# EAGLE design DoDecaCharlieCylonCR2032 (EAGLE 7.5.0)
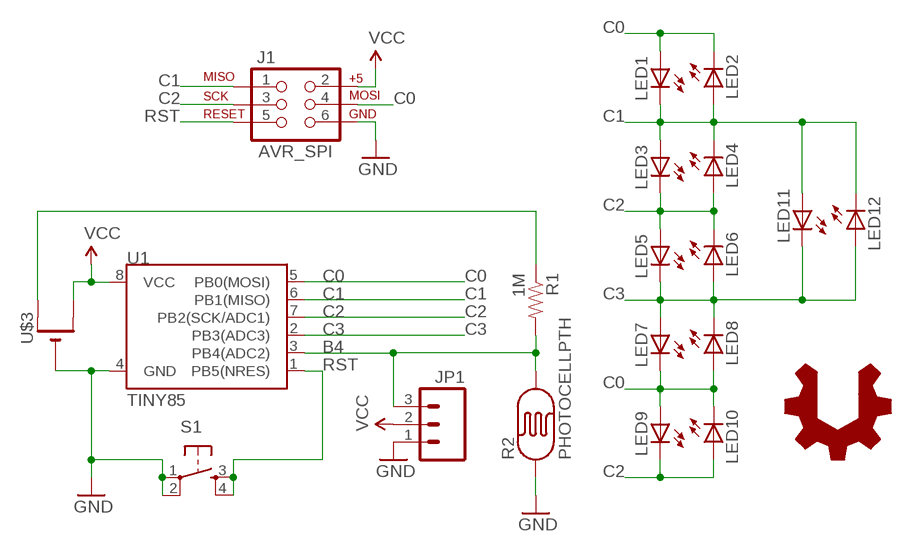
[diagram p0: schematic, sheet 1]

## Parts
J1  AVR_SPI  AVR_SPI_PRG_6LABELED  [2X3-NS]
JP1  M03PTH  [1X03]
LED1  LEDOVAL  [LED-OVAL]
LED2  LEDOVAL  [LED-OVAL]
LED3  LEDOVAL  [LED-OVAL]
LED4  LEDOVAL  [LED-OVAL]
LED5  LEDOVAL  [LED-OVAL]
LED6  LEDOVAL  [LED-OVAL]
LED7  LEDOVAL  [LED-OVAL]
LED8  LEDOVAL  [LED-OVAL]
LED9  LEDOVAL  [LED-OVAL]
LED10  LEDOVAL  [LED-OVAL]
LED11  LEDOVAL  [LED-OVAL]
LED12  LEDOVAL  [LED-OVAL]
R1  1M  RESISTORAXIAL-0.3  [AXIAL-0.3]
R2  PHOTOCELLPTH  [PHOTOCELL]
S1  TAC_SWITCHPTH  [TACTILE-PTH]
U1  TINY85  ATTINY45TINY85-20-DIP  [DIP08]
U$1  USER_HACKABLE  [USER_HACKABLE]
U$3  CR2032THM  [CR2032-THRU]

## Nets
B4: JP1.3 R1.P$2 R2.2 U1.3(PB4(ADC2))
C0: J1.4(MOSI) LED1.ANODE(A) LED2.CATHODE(C) LED7.CATHODE(C) LED8.ANODE(A) LED9.ANODE(A) LED10.CATHODE(C) U1.5(PB0(MOSI))
C1: J1.1(MISO) LED1.CATHODE(C) LED2.ANODE(A) LED3.ANODE(A) LED4.CATHODE(C) LED11.ANODE(A) LED12.CATHODE(C) U1.6(PB1(MISO))
C2: J1.3(SCK) LED3.CATHODE(C) LED4.ANODE(A) LED5.ANODE(A) LED6.CATHODE(C) LED9.CATHODE(C) LED10.ANODE(A) U1.7(PB2(SCK/ADC1))
C3: LED5.CATHODE(C) LED6.ANODE(A) LED7.ANODE(A) LED8.CATHODE(C) LED11.CATHODE(C) LED12.ANODE(A) U1.2(PB3(ADC3))
GND: J1.6(GND) JP1.1 R2.1 S1.1 S1.2 U1.4(GND) U$3.-
N$2: R1.P$1 U$3.+1(+)
RST: J1.5(RST) S1.3 S1.4 U1.1(PB5(NRES))
VCC: J1.2(V+) JP1.2 U1.8(VCC) U$3.+2(+1)

## Library data of the parts
J1 = barbary_enterprises:AVR_SPI_PRG_6: AVR ISP 6 Pin This is the reduced ISP connector for AVR programming. Common on Arduino. This footprint will take up less PCB space and can be used with a 10-pin to 6-pin adapter such as SKU: BOB-08508
JP1 = SparkFun-Connectors:M03: Header 3 Standard 3-pin 0.1" header. Use with straight break away headers (SKU : PRT-00116), right angle break away headers (PRT-00553), swiss pins (PRT-00743), machine pins (PRT-00117), and female headers (PRT-00115). Molex polarized connector foot print use with SKU : PRT-08232 with associated crimp pins and housings.
LED1-LED12 = barbary_enterprises:LED: LEDs Standard schematic elements and footprints for 5mm, 3mm, 1206, and 0603 sized LEDs. 5mm - Spark Fun Electronics SKU : COM-00529 (and others)
R1 = barbary_enterprises:RESISTOR: Resistor Basic schematic elements and footprints for 0603, 1206, and PTH resistors.
R2 = SparkFun-Sensors:PHOTOCELL: CdS photoresistor. This is a low cost way to detect light levels. Resistance decreases with more incoming light. SparkFun SKU: SEN-09088
S1 = barbary_enterprises:TAC_SWITCH: Momentary Switch Button commonly used for reset or general input. Spark Fun Electronics SKU : COM-00097 SMT- SWCH-08247
U1 = SparkFun-DigitalIC:ATTINY45: Atmel 8-pin 2/4/8kB flash uC; PROD_ID: IC-09445; VALUE: TINY85-20-DIP
U$1 = logo:USER_HACKABLE
U$3 = battery:CR2032

## Board
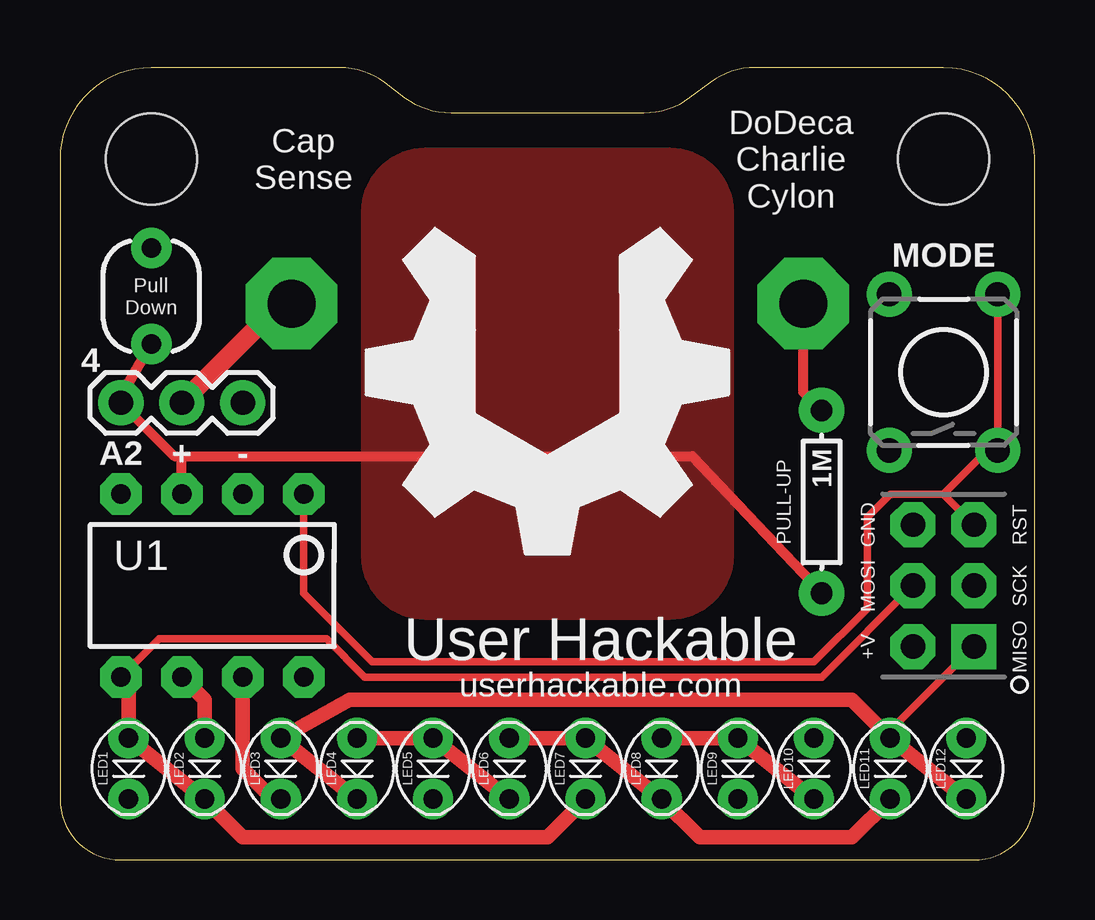
[diagram p1: board, top side]
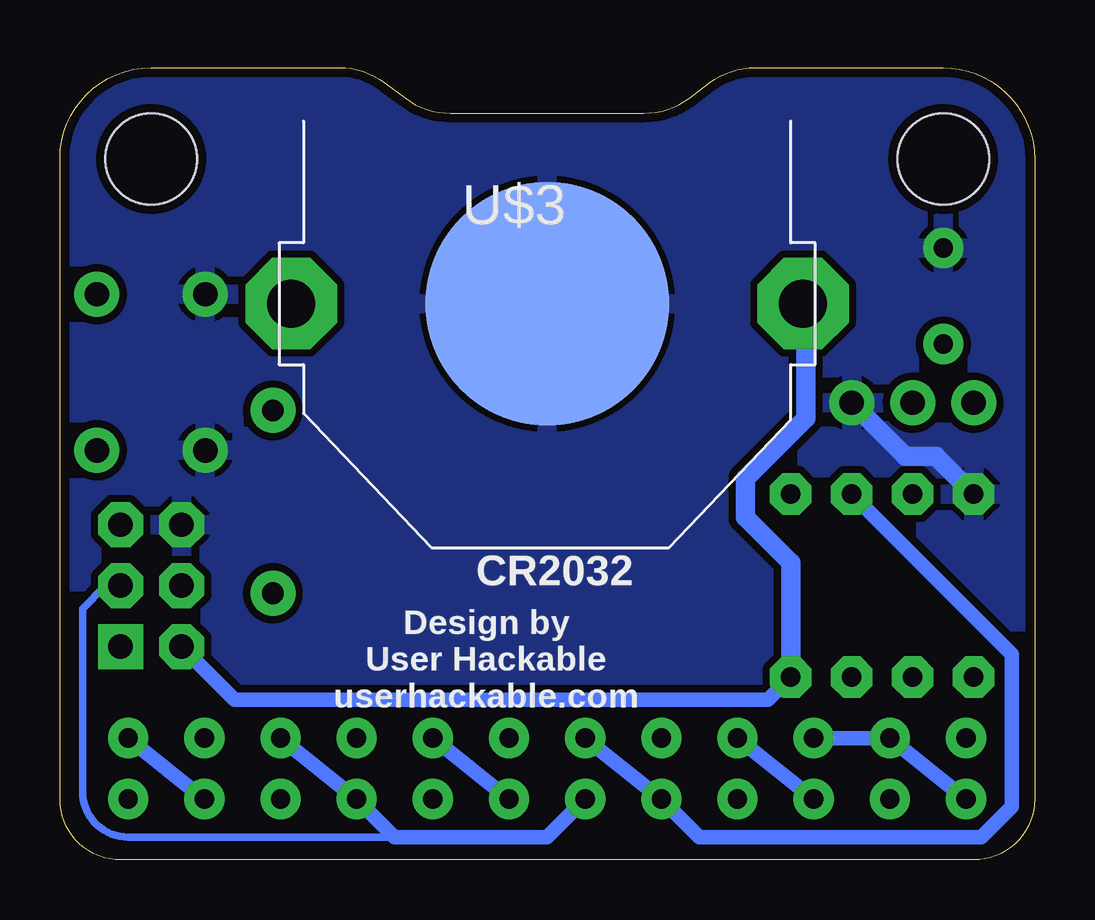
[diagram p2: board, bottom side, seen from below]

Size 40.63 x 33.02 mm. Coordinates in mm from the lower left corner, seen from the top.
Outline: 36.83,33.01 29,33.02 arc37 27.09,32.38 26.25,31.75 arc-37 24.34,31.11 16.3,31.11 arc-37 14.39,31.75 13.55,32.38 arc37 11.66,33.01 3.81,33.01 arc90 0,29.2 0,2.54 arc90 2.54,0 38.1,0 arc90 40.63,2.53 40.63,29.21 arc90 36.83,33.01
Copper layers (1*16): Top 0.0356mm / dielectric 1.5011mm / Bottom 0.0356mm
Design rules "LaenPCBOrder": minimum track width 6mil, minimum drill 13mil, track to track 6mil, track to pad 6mil, pad to pad 6mil, via to via 6mil, smd to smd 6mil, copper to edge 15mil, drill to drill 6mil, minimum pad ring 7mil, minimum via ring 7mil, stop-mask expansion 3mil, vias tented up to drill 0mil, thermal gap 10mil
Holes 3.81 mm at 3.81,29.21 36.83,29.21

### Footprints (pad centres in the part's own frame; a part is rotated, then mirrored left to right if it is on the bottom)
2X3-NS = drill 1.016 pad 1.88 square: 1 -2.54,-1.27 | drill 1.016 pad 1.88 octagon: 2 -2.54,1.27; 3 0,-1.27; 4 0,1.27; 5 2.54,-1.27; 6 2.54,1.27
1X03 = drill 1.016 pad 1.88: 1 0,0; 2 2.54,0; 3 5.08,0
LED-OVAL = drill 0.8 pad 1.676: ANODE 1.27,0; CATHODE -1.27,0
AXIAL-0.3 = drill 0.9 pad 1.88: P$1 -3.81,0; P$2 3.81,0
PHOTOCELL = drill 0.8 pad 1.676: 1 -2,0; 2 2,0
TACTILE-PTH = drill 1.016 pad 1.88: 1 -3.251,2.261; 2 3.251,2.261; 3 -3.251,-2.261; 4 3.251,-2.261
DIP08 = drill 0.813 pad 1.727 octagon: 1 -3.81,-3.81; 2 -1.27,-3.81; 3 1.27,-3.81; 4 3.81,-3.81; 5 3.81,3.81; 6 1.27,3.81; 7 -1.27,3.81; 8 -3.81,3.81
CR2032-THRU = drill 2 pad 3.81 octagon: +1 -10.668,0; +2 10.668,0 | smd 10.16 x 10.16: - 0,0

### Placement (x,y rotation side)
J1  36.83,11.43 90 top
JP1  7.62,19.05 180 top
LED1  2.86,3.81 90 top
LED2  6.03,3.81 90 top
LED3  9.21,3.81 90 top
LED4  12.38,3.81 90 top
LED5  15.56,3.81 90 top
LED6  18.73,3.81 90 top
LED7  21.91,3.81 90 top
LED8  25.08,3.81 90 top
LED9  28.26,3.81 90 top
LED10  31.43,3.81 90 top
LED11  34.61,3.81 90 top
LED12  37.78,3.81 90 top
R1  31.75,14.92 270 top
R2  3.81,23.5 270 top
S1  36.83,20.32 90 top
U1  6.35,11.43 180 top
U$1  20.32,20.32 0 top
U$3  20.32,23.18 0 bottom

### Tracks (layer width: path | path; a pad name or v marks a point on that pad's centre or on a via)
B4
  Top 0.406: U1.3 5.08,16.83 | 5.08,16.83 26.35,16.83 R1.P$2 | 5.08,16.83 4.76,16.83 JP1.3 2.44,19.14 R2.2
  pour Top: 12.7,12.7 12.7,26.99 arc-90 15.24,29.53 25.4,29.53 arc-90 27.94,26.99 27.94,12.7 arc-90 25.4,10.16 15.24,10.16 arc-90
C0
  Top 0.305: J1.4 31.75,7.62 12.7,7.62 11.11,9.21 4.13,9.21 U1.5
  Top 0.61: LED8.ANODE LED9.ANODE LED10.CATHODE | LED7.CATHODE 20.32,0.95 7.62,0.95 LED2.CATHODE LED1.ANODE 2.86,7.3 U1.5
  Bottom 0.61: LED7.CATHODE LED8.ANODE
C1
  Top 0.305: J1.1 34.61,5.4 LED11.ANODE
  Top 0.61: LED4.CATHODE LED3.ANODE 12.06,6.67 33.02,6.67 LED11.ANODE LED12.CATHODE | LED2.ANODE 6.03,6.67 U1.6
  Bottom 0.61: LED3.ANODE LED2.ANODE LED1.CATHODE
C2
  Top 0.61: LED4.ANODE LED5.ANODE LED6.CATHODE | LED3.CATHODE 8.89,2.54 7.62,3.81 U1.7
  Bottom 0.305: J1.3 38.73,11.43 39.69,10.48 39.69,2.86 arc-90 37.78,0.95 26.67,0.95
  Bottom 0.61: LED3.CATHODE LED4.ANODE | LED10.ANODE LED9.CATHODE 26.67,0.95 20.32,0.95 LED6.CATHODE
C3
  Top 0.61: LED6.ANODE LED7.ANODE LED8.CATHODE 26.67,0.95 33.02,0.95 LED11.CATHODE
  Bottom 0.61: LED6.ANODE LED5.CATHODE 13.97,0.95 2.22,0.95 0.95,2.22 0.95,8.57 U1.2 | LED11.CATHODE LED12.ANODE
GND
  Bottom 0.813: U1.4 4.13,16.83 5.4,16.83 JP1.1
  pour Bottom (isolate 0.305): 0.64,0.64 40.01,0.64 40.01,32.38 0.64,32.38
N$2
  Top 0.406: R1.P$1 30.99,19.49 U$3.+1
RST
  Top 0.305: U1.1 10.16,11.11 13.02,8.26 31.43,8.26 33.66,10.48 33.66,14.29 34.61,15.24 36.83,15.24 | 36.83,15.24 J1.5 | S1.4 S1.3 38.66,17.07 36.83,15.24
VCC
  Top 0.813: JP1.2 9.21,23.18 U$3.+2
  Bottom 0.61: U1.8 11.11,6.67 33.34,6.67 J1.2
  Bottom 0.813: U1.8 10.16,12.38 12.06,14.29 12.06,15.88 9.53,18.41 9.53,23.05 U$3.+2

### Text on the board
tPlace: Cap / Sense | DoDeca / Charlie / Cylon | MODE | Pull / Down | 4 | A2 | + | - | PULL-UP | User Hackable | userhackable.com
bPlace: CR2032 | Design by / User Hackable / userhackable.com